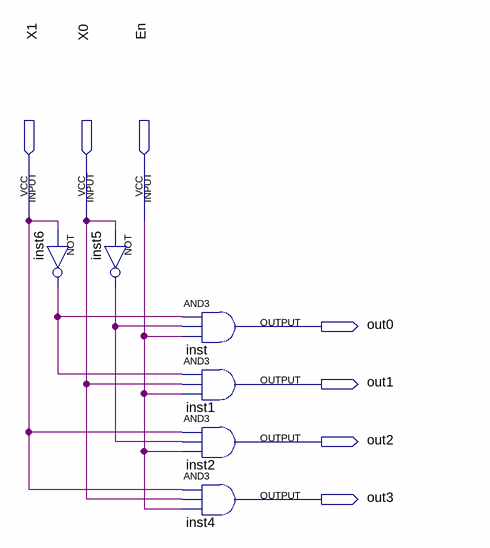
[diagram p0: schematic sheet]
// Quartus schematic Dec2_4.bdf as structural Verilog: 6 symbols, 7 pins
module Dec2_4 (
  input  X1,
  input  X0,
  input  En,
  output out0,
  output out1,
  output out2,
  output out3
);

  wire inst5_out, inst6_out;

  not inst6 (inst6_out, X1);
  not inst5 (inst5_out, X0);
  and inst (out0, inst6_out, inst5_out, En);
  and inst1 (out1, inst6_out, X0, En);
  and inst2 (out2, X1, inst5_out, En);
  and inst4 (out3, X1, X0, En);
endmodule
